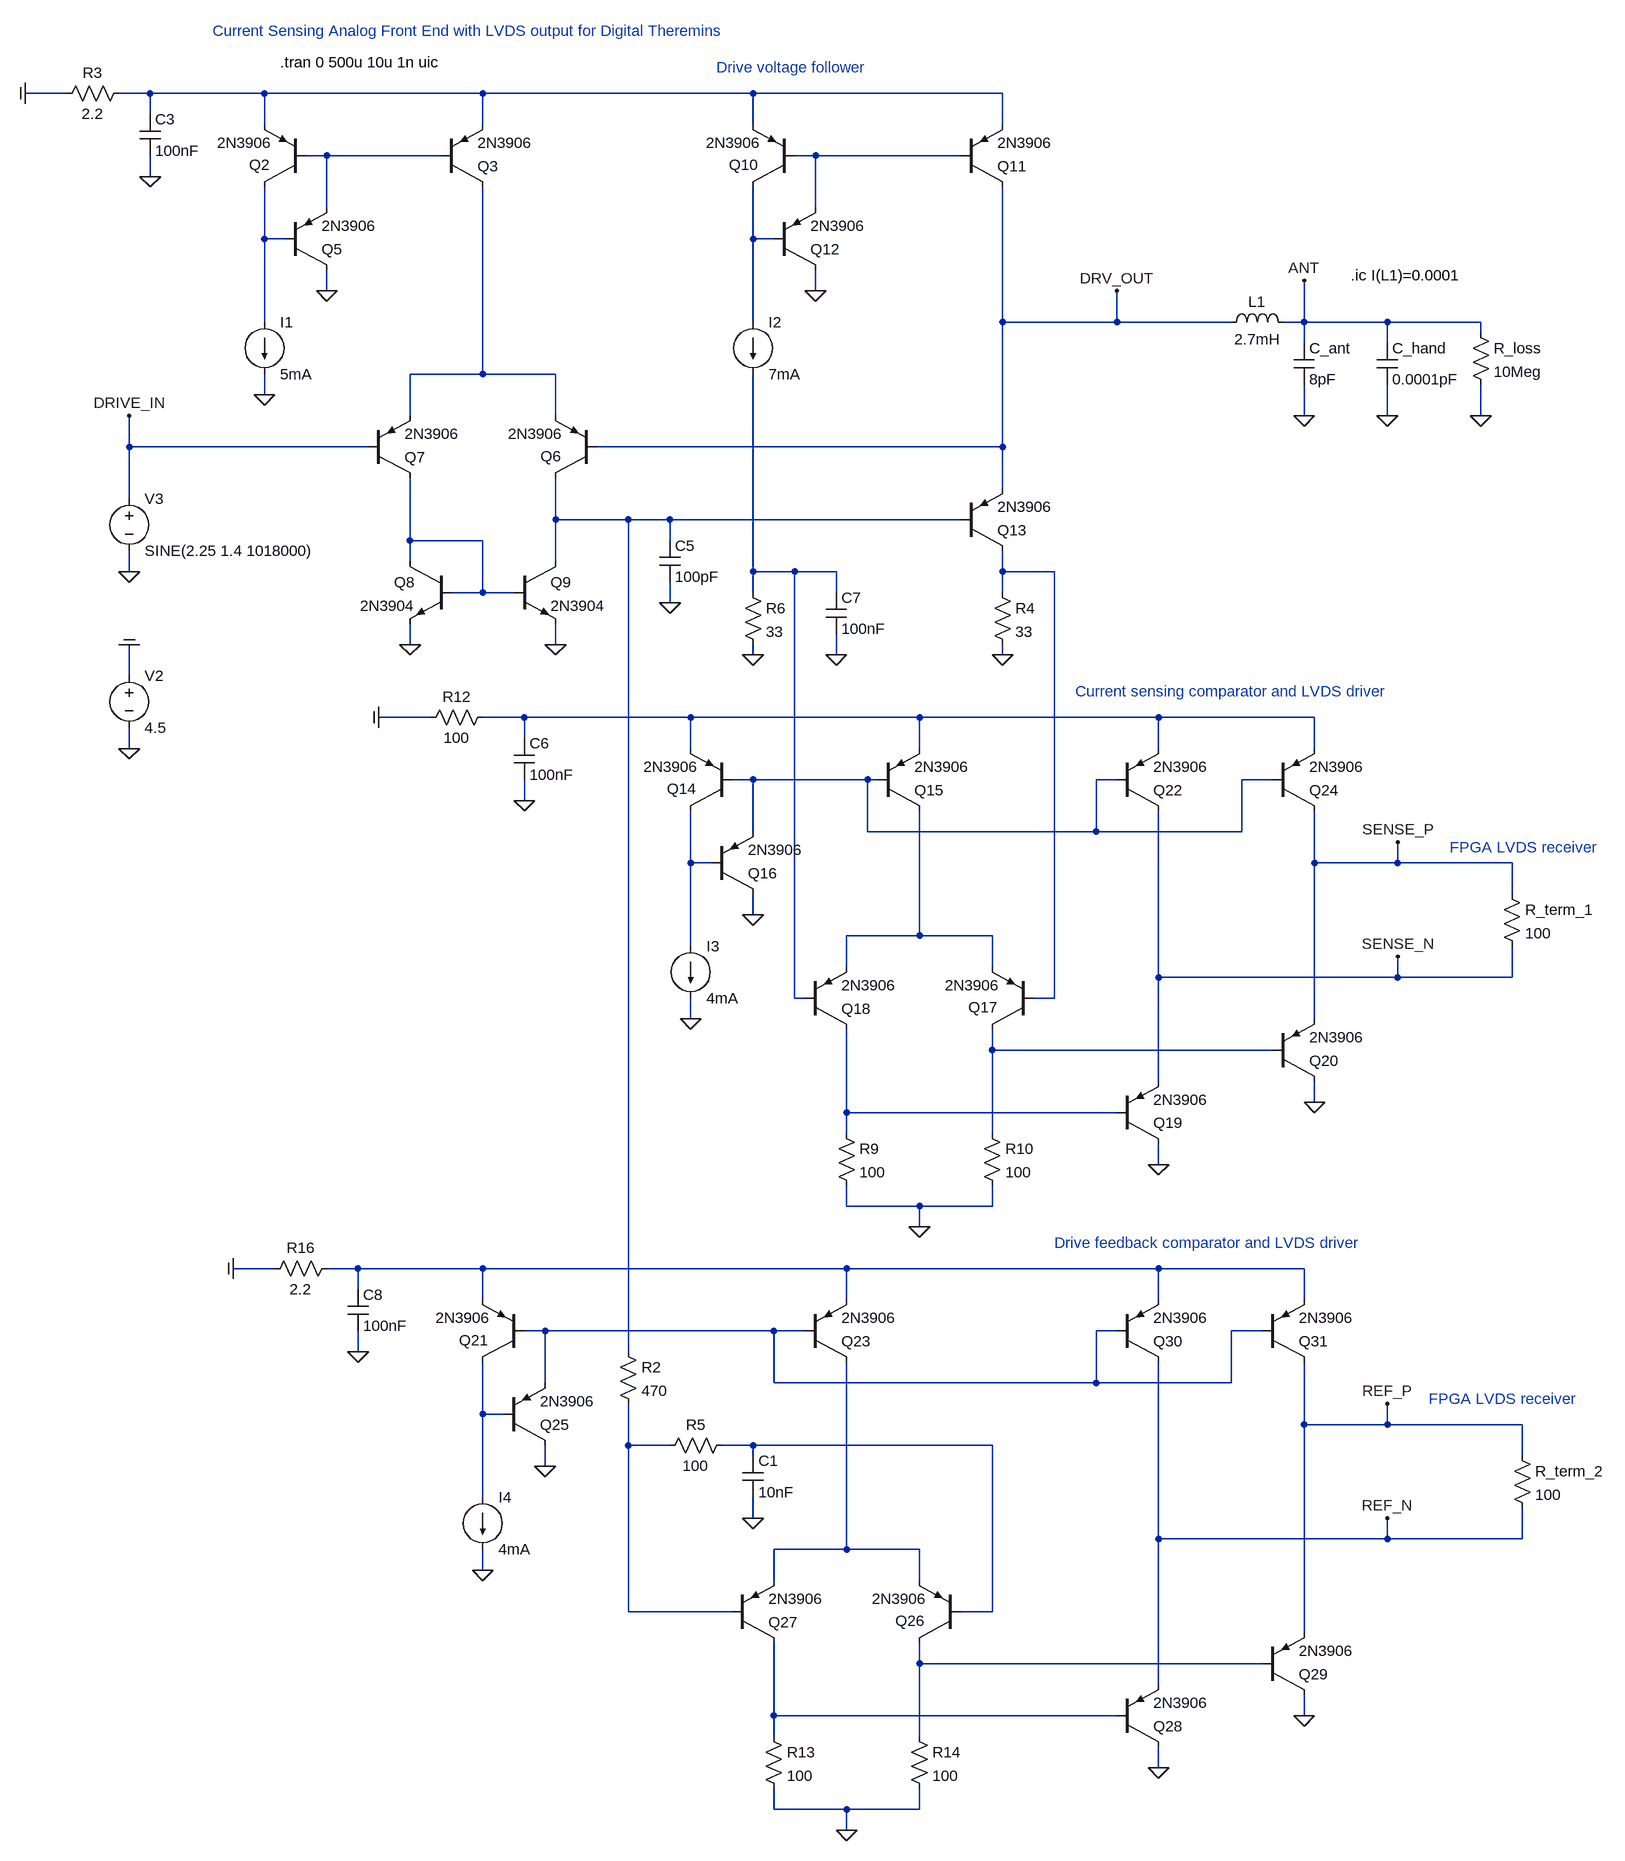
[diagram p0: schematic drive_buffer_bjt_v01.asc]
drive_buffer_bjt_v01.asc, the LTspice schematic file:
Version 4
SHEET 1 16292 23412
WIRE 8960 16672 8896 16672
WIRE 9088 16672 9040 16672
WIRE 9264 16672 9088 16672
WIRE 9600 16672 9264 16672
WIRE 10016 16672 9600 16672
WIRE 10400 16672 10016 16672
WIRE 9088 16704 9088 16672
WIRE 9264 16720 9264 16672
WIRE 9600 16720 9600 16672
WIRE 10016 16720 10016 16672
WIRE 10400 16720 10400 16672
WIRE 9360 16768 9328 16768
WIRE 9536 16768 9360 16768
WIRE 10112 16768 10080 16768
WIRE 10336 16768 10112 16768
WIRE 9088 16800 9088 16768
WIRE 9360 16848 9360 16768
WIRE 10112 16848 10112 16768
WIRE 9264 16896 9264 16816
WIRE 9296 16896 9264 16896
WIRE 10016 16896 10016 16816
WIRE 10048 16896 10016 16896
WIRE 9360 16976 9360 16944
WIRE 10112 16976 10112 16944
WIRE 9264 17024 9264 16896
WIRE 10016 17024 10016 16896
WIRE 10400 17024 10400 16816
WIRE 10576 17024 10576 16976
WIRE 10576 17024 10400 17024
WIRE 10752 17024 10576 17024
WIRE 10864 17024 10864 16960
WIRE 10864 17024 10832 17024
WIRE 10992 17024 10864 17024
WIRE 11136 17024 10992 17024
WIRE 11136 17040 11136 17024
WIRE 10864 17056 10864 17024
WIRE 10992 17056 10992 17024
WIRE 9600 17104 9600 16816
WIRE 9600 17104 9488 17104
WIRE 9712 17104 9600 17104
WIRE 9264 17136 9264 17104
WIRE 9488 17168 9488 17104
WIRE 9712 17168 9712 17104
WIRE 10864 17168 10864 17120
WIRE 10992 17168 10992 17120
WIRE 11136 17168 11136 17120
WIRE 9056 17216 9056 17168
WIRE 9424 17216 9056 17216
WIRE 10400 17216 10400 17024
WIRE 10400 17216 9776 17216
WIRE 10400 17280 10400 17216
WIRE 9056 17296 9056 17216
WIRE 9712 17328 9712 17264
WIRE 9824 17328 9712 17328
WIRE 9888 17328 9824 17328
WIRE 10336 17328 9888 17328
WIRE 9488 17360 9488 17264
WIRE 9600 17360 9488 17360
WIRE 9888 17360 9888 17328
WIRE 9488 17392 9488 17360
WIRE 9712 17392 9712 17328
WIRE 9056 17408 9056 17376
WIRE 10016 17408 10016 17104
WIRE 10080 17408 10016 17408
WIRE 10144 17408 10080 17408
WIRE 10400 17408 10400 17376
WIRE 10480 17408 10400 17408
WIRE 9600 17440 9600 17360
WIRE 9600 17440 9552 17440
WIRE 9648 17440 9600 17440
WIRE 10016 17440 10016 17408
WIRE 10144 17440 10144 17408
WIRE 10400 17440 10400 17408
WIRE 9888 17456 9888 17424
WIRE 9488 17520 9488 17488
WIRE 9712 17520 9712 17488
WIRE 10016 17536 10016 17520
WIRE 10144 17536 10144 17504
WIRE 10400 17536 10400 17520
WIRE 9056 17568 9056 17520
WIRE 9520 17632 9440 17632
WIRE 9664 17632 9600 17632
WIRE 9920 17632 9664 17632
WIRE 10272 17632 9920 17632
WIRE 10640 17632 10272 17632
WIRE 10880 17632 10640 17632
WIRE 9664 17664 9664 17632
WIRE 9056 17680 9056 17648
WIRE 9920 17680 9920 17632
WIRE 10272 17680 10272 17632
WIRE 10640 17680 10640 17632
WIRE 10880 17680 10880 17632
WIRE 10016 17728 9984 17728
WIRE 10192 17728 10016 17728
WIRE 10208 17728 10192 17728
WIRE 10576 17728 10544 17728
WIRE 10816 17728 10768 17728
WIRE 9664 17760 9664 17728
WIRE 10016 17808 10016 17728
WIRE 10192 17808 10192 17728
WIRE 10544 17808 10544 17728
WIRE 10544 17808 10192 17808
WIRE 10768 17808 10768 17728
WIRE 10768 17808 10544 17808
WIRE 9920 17856 9920 17776
WIRE 9952 17856 9920 17856
WIRE 10880 17856 10880 17776
WIRE 11008 17856 11008 17824
WIRE 11008 17856 10880 17856
WIRE 11184 17856 11008 17856
WIRE 11184 17904 11184 17856
WIRE 10016 17936 10016 17904
WIRE 10272 17968 10272 17776
WIRE 10272 17968 10160 17968
WIRE 10384 17968 10272 17968
WIRE 9920 17984 9920 17856
WIRE 10160 18016 10160 17968
WIRE 10384 18016 10384 17968
WIRE 10640 18032 10640 17776
WIRE 11008 18032 11008 18000
WIRE 11008 18032 10640 18032
WIRE 11184 18032 11184 17984
WIRE 11184 18032 11008 18032
WIRE 10080 18064 10080 17408
WIRE 10096 18064 10080 18064
WIRE 10480 18064 10480 17408
WIRE 10480 18064 10448 18064
WIRE 9920 18096 9920 18064
WIRE 10880 18096 10880 17856
WIRE 10384 18144 10384 18112
WIRE 10816 18144 10384 18144
WIRE 10640 18192 10640 18032
WIRE 10880 18224 10880 18192
WIRE 10160 18240 10160 18112
WIRE 10576 18240 10160 18240
WIRE 10160 18272 10160 18240
WIRE 10384 18272 10384 18144
WIRE 10640 18320 10640 18288
WIRE 10160 18384 10160 18352
WIRE 10272 18384 10160 18384
WIRE 10384 18384 10384 18352
WIRE 10384 18384 10272 18384
WIRE 10272 18416 10272 18384
WIRE 9280 18480 9216 18480
WIRE 9408 18480 9360 18480
WIRE 9600 18480 9408 18480
WIRE 10160 18480 9600 18480
WIRE 10640 18480 10160 18480
WIRE 10864 18480 10640 18480
WIRE 9408 18512 9408 18480
WIRE 9600 18528 9600 18480
WIRE 10160 18528 10160 18480
WIRE 10640 18528 10640 18480
WIRE 10864 18528 10864 18480
WIRE 9696 18576 9664 18576
WIRE 10048 18576 9696 18576
WIRE 10096 18576 10048 18576
WIRE 10576 18576 10544 18576
WIRE 10800 18576 10752 18576
WIRE 9408 18608 9408 18576
WIRE 9824 18608 9824 17328
WIRE 9696 18656 9696 18576
WIRE 10048 18656 10048 18576
WIRE 10544 18656 10544 18576
WIRE 10544 18656 10048 18656
WIRE 10752 18656 10752 18576
WIRE 10752 18656 10544 18656
WIRE 9600 18704 9600 18624
WIRE 9632 18704 9600 18704
WIRE 10864 18720 10864 18624
WIRE 10992 18720 10992 18688
WIRE 10992 18720 10864 18720
WIRE 11200 18720 10992 18720
WIRE 9824 18752 9824 18688
WIRE 9888 18752 9824 18752
WIRE 10016 18752 9968 18752
WIRE 10384 18752 10016 18752
WIRE 10016 18768 10016 18752
WIRE 11200 18768 11200 18720
WIRE 9696 18784 9696 18752
WIRE 9600 18832 9600 18704
WIRE 10016 18864 10016 18832
WIRE 10640 18896 10640 18624
WIRE 10992 18896 10992 18864
WIRE 10992 18896 10640 18896
WIRE 11200 18896 11200 18848
WIRE 11200 18896 10992 18896
WIRE 10160 18912 10160 18624
WIRE 10160 18912 10048 18912
WIRE 10272 18912 10160 18912
WIRE 9600 18944 9600 18912
WIRE 10048 18960 10048 18912
WIRE 10272 18960 10272 18912
WIRE 9824 19008 9824 18752
WIRE 9984 19008 9824 19008
WIRE 10384 19008 10384 18752
WIRE 10384 19008 10336 19008
WIRE 10864 19040 10864 18720
WIRE 10272 19088 10272 19056
WIRE 10800 19088 10272 19088
WIRE 10640 19120 10640 18896
WIRE 10048 19168 10048 19056
WIRE 10576 19168 10048 19168
WIRE 10864 19168 10864 19136
WIRE 10048 19200 10048 19168
WIRE 10272 19200 10272 19088
WIRE 10640 19248 10640 19216
WIRE 10048 19312 10048 19280
WIRE 10160 19312 10048 19312
WIRE 10272 19312 10272 19280
WIRE 10272 19312 10160 19312
WIRE 10160 19344 10160 19312
FLAG 9056 17680 0
FLAG 9088 16800 0
FLAG 9360 16976 0
FLAG 9488 17520 0
FLAG 9712 17520 0
FLAG 9264 17136 0
FLAG 10112 16976 0
FLAG 10400 17536 0
FLAG 10016 17536 0
FLAG 9056 17408 0
FLAG 10864 17168 0
FLAG 10864 16960 ANT
FLAG 10992 17168 0
FLAG 11136 17168 0
FLAG 9888 17456 0
FLAG 10016 17936 0
FLAG 9920 18096 0
FLAG 10640 18320 0
FLAG 10880 18224 0
FLAG 10272 18416 0
FLAG 9664 17760 0
FLAG 10144 17536 0
FLAG 9696 18784 0
FLAG 9600 18944 0
FLAG 10640 19248 0
FLAG 10864 19168 0
FLAG 10160 19344 0
FLAG 9408 18608 0
FLAG 10016 18864 0
FLAG 9056 17168 DRIVE_IN
FLAG 9056 17520 COM
FLAG 8896 16672 COM
FLAG 9440 17632 COM
FLAG 9216 18480 COM
FLAG 11008 17824 SENSE_P
FLAG 11008 18000 SENSE_N
FLAG 10992 18688 REF_P
FLAG 10992 18864 REF_N
FLAG 10576 16976 DRV_OUT
SYMBOL pnp 9328 16816 R180
WINDOW 0 55 34 Left 2
WINDOW 3 52 68 Left 2
SYMATTR InstName Q2
SYMATTR Value 2N3906
SYMBOL pnp 9536 16816 M180
SYMATTR InstName Q3
SYMATTR Value 2N3906
SYMBOL pnp 9296 16944 M180
SYMATTR InstName Q5
SYMATTR Value 2N3906
SYMBOL voltage 9056 17552 R0
WINDOW 123 0 0 Left 0
WINDOW 39 0 0 Left 0
SYMATTR InstName V2
SYMATTR Value 4.5
SYMBOL res 9056 16656 R90
WINDOW 0 0 56 VBottom 2
WINDOW 3 32 56 VTop 2
SYMATTR InstName R3
SYMATTR Value 2.2
SYMBOL cap 9072 16704 R0
SYMATTR InstName C3
SYMATTR Value 100nF
SYMBOL current 9264 17024 R0
WINDOW 123 0 0 Left 0
WINDOW 39 0 0 Left 0
SYMATTR InstName I1
SYMATTR Value 5mA
SYMBOL pnp 9776 17264 R180
WINDOW 0 55 34 Left 2
WINDOW 3 52 68 Left 2
SYMATTR InstName Q6
SYMATTR Value 2N3906
SYMBOL pnp 9424 17264 M180
SYMATTR InstName Q7
SYMATTR Value 2N3906
SYMBOL npn 9552 17392 M0
SYMATTR InstName Q8
SYMATTR Value 2N3904
SYMBOL npn 9648 17392 R0
SYMATTR InstName Q9
SYMATTR Value 2N3904
SYMBOL pnp 10080 16816 R180
WINDOW 0 55 34 Left 2
WINDOW 3 52 68 Left 2
SYMATTR InstName Q10
SYMATTR Value 2N3906
SYMBOL pnp 10336 16816 M180
SYMATTR InstName Q11
SYMATTR Value 2N3906
SYMBOL pnp 10048 16944 M180
SYMATTR InstName Q12
SYMATTR Value 2N3906
SYMBOL current 10016 17024 R0
WINDOW 123 0 0 Left 0
WINDOW 39 0 0 Left 0
SYMATTR InstName I2
SYMATTR Value 7mA
SYMBOL res 10384 17424 R0
WINDOW 0 36 40 Left 2
WINDOW 3 36 76 Left 2
SYMATTR InstName R4
SYMATTR Value 33
SYMBOL res 10000 17424 R0
WINDOW 0 36 40 Left 2
WINDOW 3 36 76 Left 2
SYMATTR InstName R6
SYMATTR Value 33
SYMBOL voltage 9056 17280 R0
WINDOW 123 0 0 Left 0
WINDOW 39 0 0 Left 0
SYMATTR InstName V3
SYMATTR Value SINE(2.25 1.4 1018000)
SYMBOL cap 10848 17056 R0
SYMATTR InstName C_ant
SYMATTR Value 8pF
SYMBOL cap 10976 17056 R0
SYMATTR InstName C_hand
SYMATTR Value 0.0001pF
SYMBOL res 11120 17024 R0
WINDOW 0 36 40 Left 2
WINDOW 3 36 76 Left 2
SYMATTR InstName R_loss
SYMATTR Value 10Meg
SYMBOL ind 10736 17040 R270
WINDOW 0 32 56 VTop 2
WINDOW 3 5 56 VBottom 2
SYMATTR InstName L1
SYMATTR Value 2.7mH
SYMATTR SpiceLine Ipk=0.5 Rser=120 Cpar=1.1pF
SYMBOL cap 9872 17360 R0
SYMATTR InstName C5
SYMATTR Value 100pF
SYMBOL pnp 10336 17376 M180
SYMATTR InstName Q13
SYMATTR Value 2N3906
SYMBOL pnp 9984 17776 R180
WINDOW 0 55 34 Left 2
WINDOW 3 52 68 Left 2
SYMATTR InstName Q14
SYMATTR Value 2N3906
SYMBOL pnp 10208 17776 M180
SYMATTR InstName Q15
SYMATTR Value 2N3906
SYMBOL pnp 9952 17904 M180
SYMATTR InstName Q16
SYMATTR Value 2N3906
SYMBOL current 9920 17984 R0
WINDOW 123 0 0 Left 0
WINDOW 39 0 0 Left 0
SYMATTR InstName I3
SYMATTR Value 4mA
SYMBOL pnp 10448 18112 R180
WINDOW 0 55 34 Left 2
WINDOW 3 52 68 Left 2
SYMATTR InstName Q17
SYMATTR Value 2N3906
SYMBOL pnp 10096 18112 M180
SYMATTR InstName Q18
SYMATTR Value 2N3906
SYMBOL res 10144 18256 R0
WINDOW 0 36 40 Left 2
WINDOW 3 36 76 Left 2
SYMATTR InstName R9
SYMATTR Value 100
SYMBOL res 10368 18256 R0
WINDOW 0 36 40 Left 2
WINDOW 3 36 76 Left 2
SYMATTR InstName R10
SYMATTR Value 100
SYMBOL pnp 10576 18288 M180
SYMATTR InstName Q19
SYMATTR Value 2N3906
SYMBOL pnp 10816 18192 M180
SYMATTR InstName Q20
SYMATTR Value 2N3906
SYMBOL pnp 10576 17776 M180
SYMATTR InstName Q22
SYMATTR Value 2N3906
SYMBOL pnp 10816 17776 M180
SYMATTR InstName Q24
SYMATTR Value 2N3906
SYMBOL res 11168 17888 R0
WINDOW 0 36 40 Left 2
WINDOW 3 36 76 Left 2
SYMATTR InstName R_term_1
SYMATTR Value 100
SYMBOL res 9616 17616 R90
WINDOW 0 0 56 VBottom 2
WINDOW 3 32 56 VTop 2
SYMATTR InstName R12
SYMATTR Value 100
SYMBOL cap 9648 17664 R0
SYMATTR InstName C6
SYMATTR Value 100nF
SYMBOL cap 10128 17440 R0
SYMATTR InstName C7
SYMATTR Value 100nF
SYMBOL pnp 9664 18624 R180
WINDOW 0 55 34 Left 2
WINDOW 3 52 68 Left 2
SYMATTR InstName Q21
SYMATTR Value 2N3906
SYMBOL pnp 10096 18624 M180
SYMATTR InstName Q23
SYMATTR Value 2N3906
SYMBOL pnp 9632 18752 M180
SYMATTR InstName Q25
SYMATTR Value 2N3906
SYMBOL current 9600 18832 R0
WINDOW 123 0 0 Left 0
WINDOW 39 0 0 Left 0
SYMATTR InstName I4
SYMATTR Value 4mA
SYMBOL pnp 10336 19056 R180
WINDOW 0 55 34 Left 2
WINDOW 3 52 68 Left 2
SYMATTR InstName Q26
SYMATTR Value 2N3906
SYMBOL pnp 9984 19056 M180
SYMATTR InstName Q27
SYMATTR Value 2N3906
SYMBOL res 10032 19184 R0
WINDOW 0 36 40 Left 2
WINDOW 3 36 76 Left 2
SYMATTR InstName R13
SYMATTR Value 100
SYMBOL res 10256 19184 R0
WINDOW 0 36 40 Left 2
WINDOW 3 36 76 Left 2
SYMATTR InstName R14
SYMATTR Value 100
SYMBOL pnp 10576 19216 M180
SYMATTR InstName Q28
SYMATTR Value 2N3906
SYMBOL pnp 10800 19136 M180
SYMATTR InstName Q29
SYMATTR Value 2N3906
SYMBOL pnp 10576 18624 M180
SYMATTR InstName Q30
SYMATTR Value 2N3906
SYMBOL pnp 10800 18624 M180
SYMATTR InstName Q31
SYMATTR Value 2N3906
SYMBOL res 11184 18752 R0
WINDOW 0 36 40 Left 2
WINDOW 3 36 76 Left 2
SYMATTR InstName R_term_2
SYMATTR Value 100
SYMBOL res 9376 18464 R90
WINDOW 0 0 56 VBottom 2
WINDOW 3 32 56 VTop 2
SYMATTR InstName R16
SYMATTR Value 2.2
SYMBOL cap 9392 18512 R0
SYMATTR InstName C8
SYMATTR Value 100nF
SYMBOL res 9808 18592 R0
WINDOW 0 36 40 Left 2
WINDOW 3 36 76 Left 2
SYMATTR InstName R2
SYMATTR Value 470
SYMBOL cap 10000 18768 R0
SYMATTR InstName C1
SYMATTR Value 10nF
SYMBOL res 9984 18736 R90
WINDOW 0 0 56 VBottom 2
WINDOW 3 32 56 VTop 2
SYMATTR InstName R5
SYMATTR Value 100
TEXT 9288 16624 Left 2 !.tran 0 500u 10u 1n uic
TEXT 9184 16576 Left 2 ;Current Sensing Analog Front End with LVDS output for Digital Theremins
TEXT 10936 16952 Left 2 !.ic I(L1)=0.0001
TEXT 11056 18680 Left 2 ;FPGA LVDS receiver
TEXT 11088 17832 Left 2 ;FPGA LVDS receiver
TEXT 10512 17592 Left 2 ;Current sensing comparator and LVDS driver
TEXT 10480 18440 Left 2 ;Drive feedback comparator and LVDS driver
TEXT 9960 16632 Left 2 ;Drive voltage follower

The netlist it stands for:
* drive_buffer_bjt_v01.asc
Q2 N004 N002 N001 0 2N3906
Q3 N006 N002 N001 0 2N3906
Q5 0 N004 N002 0 2N3906
V2 COM 0 4.5
R3 N001 COM 2.2
C3 N001 0 100nF
I1 N004 0 5mA
Q6 N007 DRV_OUT N006 0 2N3906
Q7 N008 DRIVE_IN N006 0 2N3906
Q8 N008 N008 0 0 2N3904
Q9 N007 N008 0 0 2N3904
Q10 N005 N003 N001 0 2N3906
Q11 DRV_OUT N003 N001 0 2N3906
Q12 0 N005 N003 0 2N3906
I2 N005 N009 7mA
R4 N010 0 33
R6 N009 0 33
V3 DRIVE_IN 0 SINE(2.25 1.4 1018000)
C_ant ANT 0 8pF
C_hand ANT 0 0.0001pF
R_loss ANT 0 10Meg
L1 DRV_OUT ANT 2.7mH Ipk=0.5 Rser=120 Cpar=1.1pF
C5 N007 0 100pF
Q13 N010 N007 DRV_OUT 0 2N3906
Q14 N013 N012 N011 0 2N3906
Q15 N014 N012 N011 0 2N3906
Q16 0 N013 N012 0 2N3906
I3 N013 0 4mA
Q17 N015 N010 N014 0 2N3906
Q18 N016 N009 N014 0 2N3906
R9 N016 0 100
R10 N015 0 100
Q19 0 N016 SENSE_N 0 2N3906
Q20 0 N015 SENSE_P 0 2N3906
Q22 SENSE_N N012 N011 0 2N3906
Q24 SENSE_P N012 N011 0 2N3906
R_term_1 SENSE_P SENSE_N 100
R12 N011 COM 100
C6 N011 0 100nF
C7 N009 0 100nF
Q21 N019 N018 N017 0 2N3906
Q23 N022 N018 N017 0 2N3906
Q25 0 N019 N018 0 2N3906
I4 N019 0 4mA
Q26 N023 N021 N022 0 2N3906
Q27 N024 N020 N022 0 2N3906
R13 N024 0 100
R14 N023 0 100
Q28 0 N024 REF_N 0 2N3906
Q29 0 N023 REF_P 0 2N3906
Q30 REF_N N018 N017 0 2N3906
Q31 REF_P N018 N017 0 2N3906
R_term_2 REF_P REF_N 100
R16 N017 COM 2.2
C8 N017 0 100nF
R2 N007 N020 470
C1 N021 0 10nF
R5 N021 N020 100
.model NPN NPN
.model PNP PNP
.lib standard.bjt
.tran 0 500u 10u 1n uic
* Current Sensing Analog Front End with LVDS output for Digital Theremins
.ic I(L1)=0.0001
* FPGA LVDS receiver
* FPGA LVDS receiver
* Current sensing comparator and LVDS driver
* Drive feedback comparator and LVDS driver
* Drive voltage follower
.backanno
.end